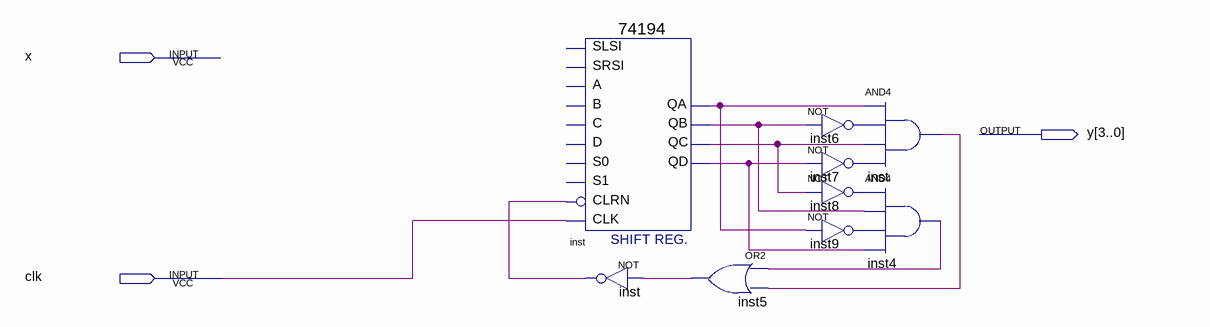
[diagram p0: schematic sheet]
// Quartus schematic 2.bdf as structural Verilog: 9 symbols, 3 pins
module \2  (
  input  x,
  input  clk,
  output [3:0] y
);

  wire inst4_out, inst5_out, inst6_out, inst7_out, inst8_out, inst9_out, inst_out, inst_out_2, inst_qa,
       inst_qb, inst_qc, inst_qd;

  \74194  inst (
    .CLK(clk), .CLRN(inst_out), .QA(inst_qa), .QB(inst_qb), .QC(inst_qc), .QD(inst_qd));  // open: SLSI, SRSI, B, C, D, S1, S0, A
  not inst_dup2 (inst_out, inst5_out);
  or inst5 (inst5_out, inst4_out, inst_out_2);
  and inst_dup3 (inst_out_2, inst_qa, inst6_out, inst_qc, inst7_out);
  not inst6 (inst6_out, inst_qb);
  not inst7 (inst7_out, inst_qd);
  and inst4 (inst4_out, inst8_out, inst_qb, inst9_out, inst_qd);
  not inst8 (inst8_out, inst_qc);
  not inst9 (inst9_out, inst_qa);
endmodule
